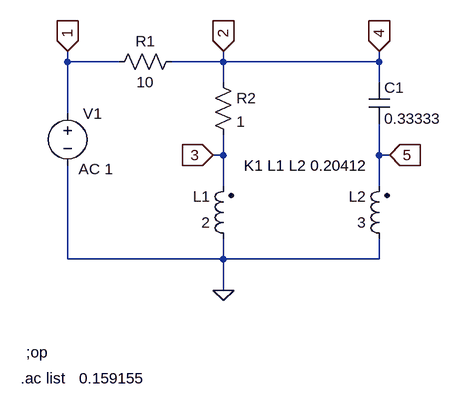
[diagram p0: schematic coupled inductors circuit 1.asc]
coupled inductors circuit 1.asc, the LTspice schematic file:
Version 4
SHEET 1 880 680
WIRE -64 -48 -64 -64
WIRE 16 -48 -64 -48
WIRE 176 -48 176 -64
WIRE 176 -48 96 -48
WIRE 416 -48 416 -64
WIRE 416 -48 176 -48
WIRE 176 -16 176 -48
WIRE 416 -16 416 -48
WIRE -64 32 -64 -48
WIRE 176 96 176 64
WIRE 176 96 160 96
WIRE 416 96 416 48
WIRE 432 96 416 96
WIRE 176 144 176 96
WIRE 416 144 416 96
WIRE -64 256 -64 112
WIRE 176 256 176 224
WIRE 176 256 -64 256
WIRE 416 256 416 224
WIRE 416 256 176 256
WIRE 176 304 176 256
FLAG 176 304 0
FLAG -64 -64 1
IOPIN -64 -64 In
FLAG 176 -64 2
IOPIN 176 -64 In
FLAG 416 -64 4
IOPIN 416 -64 In
FLAG 160 96 3
IOPIN 160 96 In
FLAG 432 96 5
IOPIN 432 96 In
SYMBOL ind2 192 240 R180
WINDOW 0 36 80 Left 2
WINDOW 3 36 40 Left 2
SYMATTR InstName L1
SYMATTR Value 2
SYMATTR Type ind
SYMBOL ind2 432 240 R180
WINDOW 0 36 80 Left 2
WINDOW 3 36 40 Left 2
SYMATTR InstName L2
SYMATTR Value 3
SYMATTR Type ind
SYMBOL cap 400 -16 R0
SYMATTR InstName C1
SYMATTR Value 0.33333
SYMBOL res 0 -32 R270
WINDOW 0 32 56 VTop 2
WINDOW 3 0 56 VBottom 2
SYMATTR InstName R1
SYMATTR Value 10
SYMBOL res 160 -32 R0
SYMATTR InstName R2
SYMATTR Value 1
SYMBOL voltage -64 16 R0
WINDOW 3 8 115 Invisible 2
WINDOW 123 17 101 Left 2
WINDOW 39 0 0 Left 2
SYMATTR Value ""
SYMATTR Value2 AC 1
SYMATTR InstName V1
TEXT 208 112 Left 2 !K1 L1 L2 0.20412
TEXT -128 400 Left 2 !;op
TEXT -136 440 Left 2 !.ac list   0.159155

The netlist it stands for:
* coupled inductors circuit 1.asc
L1 0 3 2
L2 0 5 3
C1 4 5 0.33333
R1 1 4 10
R2 4 3 1
V1 1 0 AC 1
K1 L1 L2 0.20412
;op
.ac list   0.159155
.backanno
.end